# EasyEDA Pro project project.epro, schematic Schematic1
Board Name: Board1; Create Date: 2025-07-10; Page Name: P1; Project Name: Retro Core 16x32 Motherboard V4; Schematic Name: Schematic1; Update Date: 2025-07-10; Company: EasyEDA.com; Drawn: EasyEDA; Page Size: A4; Part Number: JLCPCB-002; Reviewed: EasyEDA; Version: V0.1
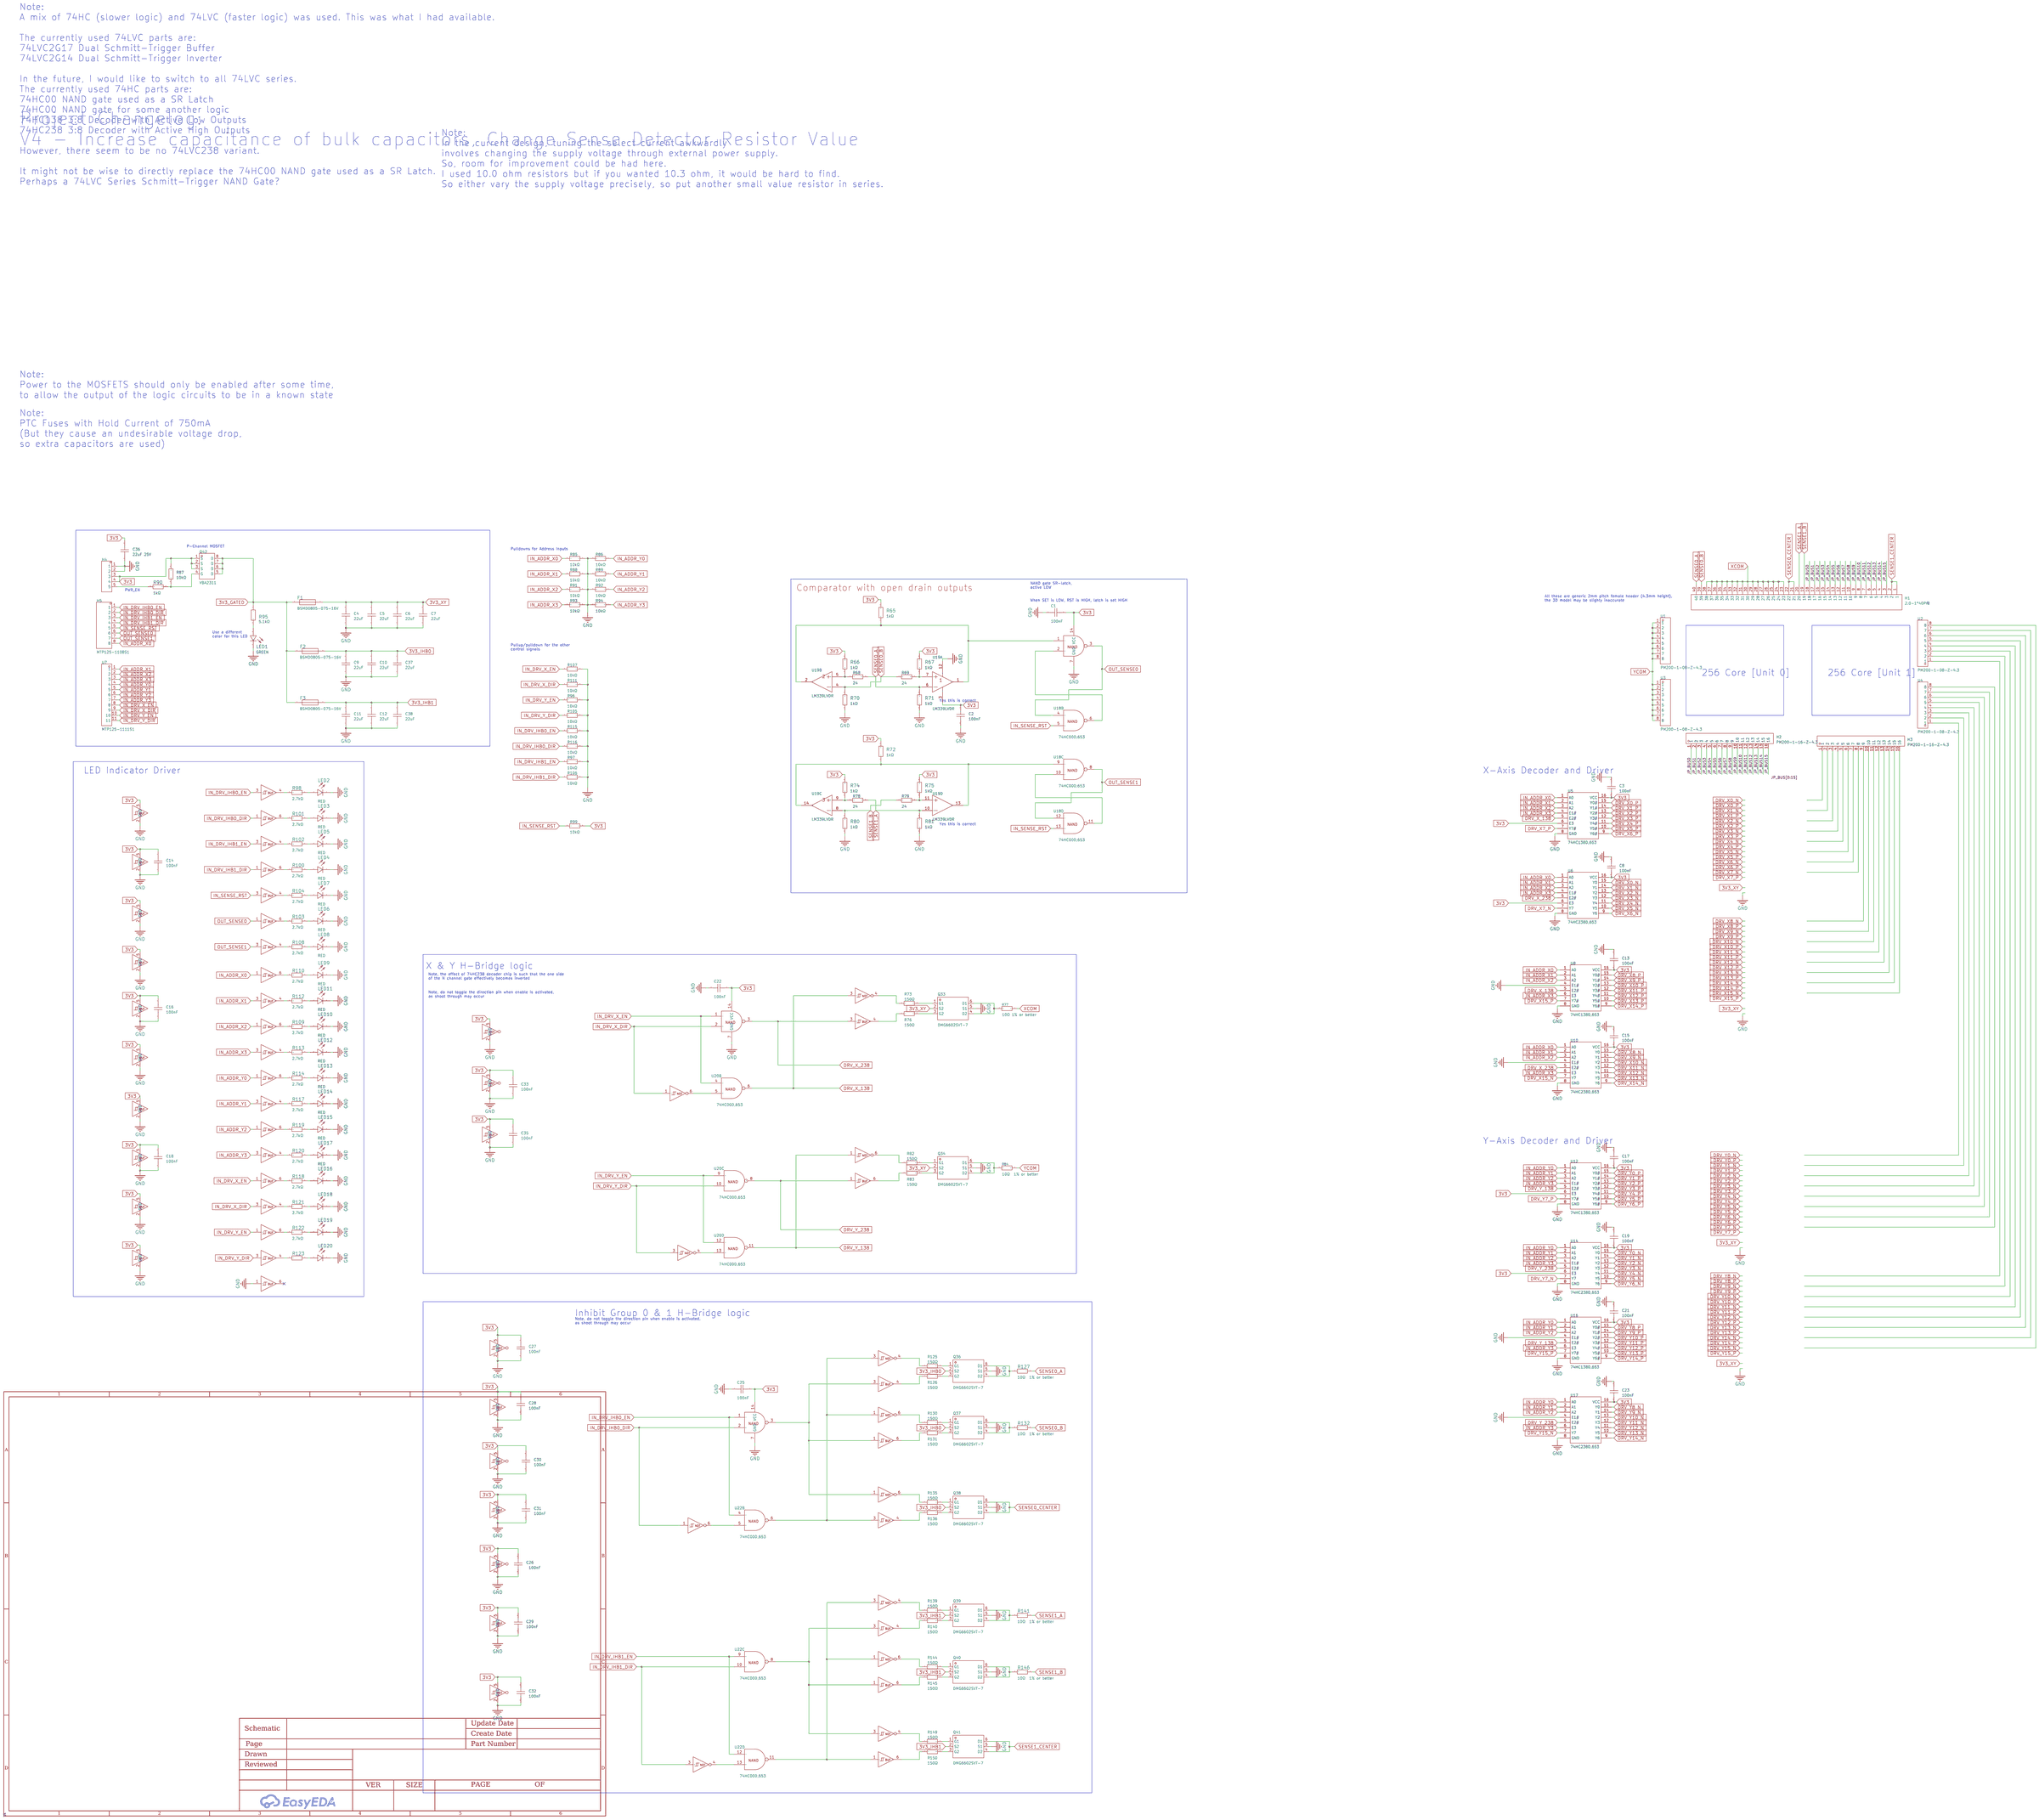
[diagram p1: schematic sheet]

## Parts
C1  100nF  [C0603]
C2  100nF  [C0603]
C3  100nF  [C0603]
C4  22uF  [C0805]
C5  22uF  [C0805]
C6  22uF  [C0805]
C7  22uF  [C0805]
C8  100nF  [C0603]
C9  22uF  [C0805]
C10  22uF  [C0805]
C11  22uF  [C0805]
C12  22uF  [C0805]
C13  100nF  [C0603]
C14  100nF  [C0603]
C15  100nF  [C0603]
C16  100nF  [C0603]
C17  100nF  [C0603]
C18  100nF  [C0603]
C19  100nF  [C0603]
C21  100nF  [C0603]
C22  100nF  [C0603]
C23  100nF  [C0603]
C25  100nF  [C0603]
C26  100nF  [C0603]
C27  100nF  [C0603]
C28  100nF  [C0603]
C29  100nF  [C0603]
C30  100nF  [C0603]
C31  100nF  [C0603]
C32  100nF  [C0603]
C33  100nF  [C0603]
C35  100nF  [C0603]
C36  22uF  [C0805]
C37  22uF  [C0805]
C38  22uF  [C0805]
CBB1  -
CBB2  -
CBB3  -
CBB4  -
F1  BSMD0805-075-16V  [F0805]
F2  BSMD0805-075-16V  [F0805]
F3  BSMD0805-075-16V  [F0805]
H1  2.0-1*40P母  [HDR-TH_40P-P2.00-V-F]
H2  PM200-1-16-Z-4.3  [HDR-TH_16P-P2.00-V-F]
H3  PM200-1-16-Z-4.3  [HDR-TH_16P-P2.00-V-F]
H4  -  [HDR-TH_5P-P2.54-V-M-NO-SILKSCREEN]
H5  MTP125-1108S1  [HDR-TH_8P-P2.54-H-M-NO-SILKSCREEN]
LED1  GREEN  [LED0603-RD]
LED2  RED  [LED0603-RD]
LED3  RED  [LED0603-RD]
LED4  RED  [LED0603-RD]
LED5  RED  [LED0603-RD]
LED6  RED  [LED0603-RD]
LED7  RED  [LED0603-RD]
LED8  RED  [LED0603-RD]
LED9  RED  [LED0603-RD]
LED10  RED  [LED0603-RD]
LED11  RED  [LED0603-RD]
LED12  RED  [LED0603-RD]
LED13  RED  [LED0603-RD]
LED14  RED  [LED0603-RD]
LED15  RED  [LED0603-RD]
LED16  RED  [LED0603-RD]
LED17  RED  [LED0603-RD]
LED18  RED  [LED0603-RD]
LED19  RED  [LED0603-RD]
LED20  RED  [LED0603-RD]
Q33  DMG6602SVT-7  [TSOT-23-6_L2.9-W1.6-P0.95-LS2.8-BR]
Q34  DMG6602SVT-7  [TSOT-23-6_L2.9-W1.6-P0.95-LS2.8-BR]
Q36  DMG6602SVT-7  [TSOT-23-6_L2.9-W1.6-P0.95-LS2.8-BR]
Q37  DMG6602SVT-7  [TSOT-23-6_L2.9-W1.6-P0.95-LS2.8-BR]
Q38  DMG6602SVT-7  [TSOT-23-6_L2.9-W1.6-P0.95-LS2.8-BR]
Q39  DMG6602SVT-7  [TSOT-23-6_L2.9-W1.6-P0.95-LS2.8-BR]
Q40  DMG6602SVT-7  [TSOT-23-6_L2.9-W1.6-P0.95-LS2.8-BR]
Q41  DMG6602SVT-7  [TSOT-23-6_L2.9-W1.6-P0.95-LS2.8-BR]
Q42  VBA2311  [SO-8_L4.9-W3.9-P1.27-LS5.9-BL]
R65  1kΩ  [R0603]
R66  1kΩ  [R0603]
R67  1kΩ  [R0603]
R68  24  [R0603]
R69  24  [R0603]
R70  1kΩ  [R0603]
R71  1kΩ  [R0603]
R72  1kΩ  [R0603]
R73  150Ω  [R0603]
R74  1kΩ  [R0603]
R75  1kΩ  [R0603]
R76  150Ω  [R0603]
R77  10Ω  [R1210]
R78  24  [R0603]
R79  24  [R0603]
R80  1kΩ  [R0603]
R81  1kΩ  [R0603]
R82  150Ω  [R0603]
R83  150Ω  [R0603]
R84  10Ω  [R1210]
R85  10kΩ  [R0603]
R86  10kΩ  [R0603]
R87  10kΩ  [R0603]
R88  10kΩ  [R0603]
R89  10kΩ  [R0603]
R90  1kΩ  [R0603]
R91  10kΩ  [R0603]
R92  10kΩ  [R0603]
R93  10kΩ  [R0603]
R94  10kΩ  [R0603]
R95  5.1kΩ  [R0603]
R96  10kΩ  [R0603]
R97  10kΩ  [R0603]
R98  2.7kΩ  [R0603]
R99  10kΩ  [R0603]
R100  2.7kΩ  [R0603]
R101  2.7kΩ  [R0603]
R102  2.7kΩ  [R0603]
R103  2.7kΩ  [R0603]
R104  2.7kΩ  [R0603]
R105  10kΩ  [R0603]
R106  10kΩ  [R0603]
R107  10kΩ  [R0603]
R108  2.7kΩ  [R0603]
R109  2.7kΩ  [R0603]
R110  2.7kΩ  [R0603]
R111  10kΩ  [R0603]
R112  2.7kΩ  [R0603]
R113  2.7kΩ  [R0603]
R114  2.7kΩ  [R0603]
R115  10kΩ  [R0603]
R116  10kΩ  [R0603]
R117  2.7kΩ  [R0603]
R118  2.7kΩ  [R0603]
R119  2.7kΩ  [R0603]
R120  2.7kΩ  [R0603]
R121  2.7kΩ  [R0603]
R122  2.7kΩ  [R0603]
R123  2.7kΩ  [R0603]
R125  150Ω  [R0603]
R126  150Ω  [R0603]
R127  10Ω  [R1210]
R130  150Ω  [R0603]
R131  150Ω  [R0603]
R132  10Ω  [R1210]
R135  150Ω  [R0603]
R136  150Ω  [R0603]
R139  150Ω  [R0603]
R140  150Ω  [R0603]
R141  10Ω  [R1210]
R144  150Ω  [R0603]
R145  150Ω  [R0603]
R146  10Ω  [R1210]
R149  150Ω  [R0603]
R150  150Ω  [R0603]
U1  PM200-1-08-Z-4.3  [HDR-TH_8P-P2.00-V-F]
U2  PM200-1-08-Z-4.3  [HDR-TH_8P-P2.00-V-F]
U3  PM200-1-08-Z-4.3  [HDR-TH_8P-P2.00-V-F]
U4  PM200-1-08-Z-4.3  [HDR-TH_8P-P2.00-V-F]
U5  74HC138D,653  [SOIC-16_L9.9-W3.9-P1.27-LS6.0-BL]
U6  74HC238D,653  [SOIC-16_L9.9-W3.9-P1.27-LS6.0-BL]
U7  MTP125-1111S1  [HDR-TH_11P-P2.54-V-M]
U8  74HC138D,653  [SOIC-16_L9.9-W3.9-P1.27-LS6.0-BL]
U10  74HC238D,653  [SOIC-16_L9.9-W3.9-P1.27-LS6.0-BL]
U12  74HC138D,653  [SOIC-16_L9.9-W3.9-P1.27-LS6.0-BL]
U14  74HC238D,653  [SOIC-16_L9.9-W3.9-P1.27-LS6.0-BL]
U16  74HC138D,653  [SOIC-16_L9.9-W3.9-P1.27-LS6.0-BL]
U17  74HC238D,653  [SOIC-16_L9.9-W3.9-P1.27-LS6.0-BL]
U18  74HC00D,653  [SOIC-14_L8.7-W3.9-P1.27-LS6.0-BL]  (sections 1,2,3,4)
U19  LM339LVDR  [SOIC-14_L8.7-W3.9-P1.27-LS6.0-BL]  (sections 1,2,3,4)
U20  74HC00D,653  [SOIC-14_L8.7-W3.9-P1.27-LS6.0-BL]  (sections 1,2,3,4)
U22  74HC00D,653  [SOIC-14_L8.7-W3.9-P1.27-LS6.0-BL]  (sections 1,2,3,4)
U26  SN74LVC2G17DBVR  [SOT-23-6_L2.9-W1.6-P0.95-LS2.8-BL]  (sections 1,3,4)
U27  SN74LVC2G17DBVR  [SOT-23-6_L2.9-W1.6-P0.95-LS2.8-BL]  (sections 1,3,4)
U28  SN74LVC2G17DBVR  [SOT-23-6_L2.9-W1.6-P0.95-LS2.8-BL]  (sections 1,3,4)
U29  SN74LVC2G17DBVR  [SOT-23-6_L2.9-W1.6-P0.95-LS2.8-BL]  (sections 1,3,4)
U30  SN74LVC2G17DBVR  [SOT-23-6_L2.9-W1.6-P0.95-LS2.8-BL]  (sections 1,3,4)
U31  SN74LVC2G17DBVR  [SOT-23-6_L2.9-W1.6-P0.95-LS2.8-BL]  (sections 1,3,4)
U32  SN74LVC2G17DBVR  [SOT-23-6_L2.9-W1.6-P0.95-LS2.8-BL]  (sections 1,3,4)
U33  SN74LVC2G17DBVR  [SOT-23-6_L2.9-W1.6-P0.95-LS2.8-BL]  (sections 1,3,4)
U34  SN74LVC2G17DBVR  [SOT-23-6_L2.9-W1.6-P0.95-LS2.8-BL]  (sections 1,3,4)
U35  SN74LVC2G17DBVR  [SOT-23-6_L2.9-W1.6-P0.95-LS2.8-BL]  (sections 1,3,4)
U36  SN74LVC2G14DBVR  [SOT-23-6_L2.9-W1.6-P0.95-LS2.8-BL]  (sections 1,2,3)
U37  SN74LVC2G14DBVR  [SOT-23-6_L2.9-W1.6-P0.95-LS2.8-BL]  (sections 1,2,3)
U38  SN74LVC2G17DBVR  [SOT-23-6_L2.9-W1.6-P0.95-LS2.8-BL]  (sections 1,3,4)
U39  SN74LVC2G14DBVR  [SOT-23-6_L2.9-W1.6-P0.95-LS2.8-BL]  (sections 1,2,3)
U40  SN74LVC2G17DBVR  [SOT-23-6_L2.9-W1.6-P0.95-LS2.8-BL]  (sections 1,3,4)
U41  SN74LVC2G14DBVR  [SOT-23-6_L2.9-W1.6-P0.95-LS2.8-BL]  (sections 1,2,3)
U42  SN74LVC2G17DBVR  [SOT-23-6_L2.9-W1.6-P0.95-LS2.8-BL]  (sections 1,3,4)
U43  SN74LVC2G14DBVR  [SOT-23-6_L2.9-W1.6-P0.95-LS2.8-BL]  (sections 1,2,3)
U44  SN74LVC2G14DBVR  [SOT-23-6_L2.9-W1.6-P0.95-LS2.8-BL]  (sections 1,2,3)
U45  SN74LVC2G17DBVR  [SOT-23-6_L2.9-W1.6-P0.95-LS2.8-BL]  (sections 1,3,4)

## Library data of the parts
C1-C3 C8 C13-C19 C21-C23 C25-C33 C35 = CAP_0603: Supplier Footprint: 0603
C4-C7 C9-C12 C36-C38 = CL21A226MAYNNNE: Capacitance: Tolerance:±20% Tolerance:±20% Voltage Rated: Temperature Coefficient:; LCSC Part Name: 22uF ±20% 25V; Supplier Part: C602037; Manufacturer: SAMSUNG(三星); Supplier Footprint: 0805; JLCPCB Part Class: Extended Part; Datasheet: https://atta.szlcsc.com/upload/public/pdf/source/20200609/C602037_1A0D619693E608A1BF6E80154254E2DB.pdf; Supplier: LCSC; Tolerance: ±20%
F1-F3 = BSMD0805-075-16V: Operating Voltage (Max):16V Current Rating (Max):40A Hold Current:750mA Trip Current:1.5A Power Dissipation:600mW Resistance - Initial (Ri) (Min):70mΩ Resistance - Post Trip (R1) (Max):385mΩ Maximum Time to Trip:200ms Operating Temperature:-40℃~+85℃ Opera; LCSC Part Name: 16V 750mA 0805自恢复; Supplier Part: C976303; Manufacturer: BHFUSE(佰宏); Supplier Footprint: 0805; JLCPCB Part Class: Extended Part; Datasheet: https://atta.szlcsc.com/upload/public/pdf/source/20230512/7A46D6CD923C15CBB98FD769C08EDD80.pdf; Supplier: LCSC; Operating Voltage (Max): 16V; Current Rating (Max): 40A; Hold Current: 750mA; Trip Current: 1.5A; Power Dissipation: 600mW; Resistance - Initial (Ri) (Min): 70mΩ; Resistance - Post Trip (R1) (Max): 385mΩ; Maximum Time to Trip: 200ms; Operating Temperature: -40℃~+85℃
H1 = 2.0-1*40P母: Holes Structure:1x40P Pitch:2mm Row Spacing:- Mounting Type:Straight Number of Rows:Single Row Number of Positions:40P Insulation Height:- Contact Material:Brass Contact Plating:Gold; LCSC Part Name: 间距:2mm 1x40P 直插; Supplier Part: C7243; Manufacturer: BOOMELE(博穆精密); Supplier Footprint: 插件,P=2mm; JLCPCB Part Class: Extended Part; Datasheet: https://atta.szlcsc.com/upload/public/pdf/source/20160318/1458266988932.pdf; Supplier: LCSC; Holes Structure: 1x40P; Pitch: 2mm; Mounting Type: Straight; Number of Rows: Single Row; Number of Positions: 40P; Contact Material: Brass; Contact Plating: Gold
H2 H3 = PM200-1-16-Z-4.3: Holes Structure:1x16P Pitch:2mm Row Spacing:- Circular Hole / Square Hole:方孔 Mounting Type:Straight Number of Rows:Plugin Number of Holes:16P Current Rating (Max):1.5A Holes Direction:Top Insulation Height:4.3mm Contact Material:Brass Operating Temperatur; LCSC Part Name: 1x16P 间距:2mm 直插; Supplier Part: C3012142; Manufacturer: HCTL(华灿天禄); Supplier Footprint: 插件,P=2mm; JLCPCB Part Class: Extended Part; Datasheet: https://atta.szlcsc.com/upload/public/pdf/source/20230609/46B4B774BFB018712E18BE862FE6FD01.pdf; Supplier: LCSC; Holes Structure: 1x16P; Pitch: 2mm; Circular Hole / Square Hole: 方孔; Mounting Type: Straight; Number of Rows: Plugin; Number of Holes: 16P; Current Rating (Max): 1.5A; Holes Direction: Top; Insulation Height: 4.3mm; Contact Material: Brass; Operating Temperature Range: -40℃~+105℃; Soldering Temperature(Max): 260℃@10S
H4 = HDR-M_2.54_1x5P: Supplier Footprint: Through
H5 = MTP125-1108S1: Pin Structure:1x8P Pitch:2.54mm Row Spacing:- Circluar Pins/Square Pins:Square Pins Mounting Type:Straight Number of Rows:Plugin Number of Pins:8P Current Rating (Max):- Voltage Rating (Max):- Length of Mating Pin:6mm Insulation Height:2.5mm Length of End; LCSC Part Name: 间距:2.54mm 1x8P 直插 方针; Supplier Part: C358689; Manufacturer: MINTRON(明硕); Supplier Footprint: 插件,P=2.54mm; JLCPCB Part Class: Extended Part; Datasheet: https://atta.szlcsc.com/upload/public/pdf/source/20190124/C358691_14EEE47B6F852A185E1BED738B24D535.pdf; Supplier: LCSC; Pin Structure: 1x8P; Pitch: 2.54mm; Circluar Pins/Square Pins: Square Pins; Mounting Type: Straight; Number of Rows: Plugin; Number of Pins: 8P; Length of Mating Pin: 6mm; Insulation Height: 2.5mm; Length of End Connection Pin: 3mm; Operating Temperature Range: -40℃~+105℃; Color: Black
LED1-LED20 = 19-217/R6C-AL1M2VY/3T: Emitted Color:Red Forward Voltage (VF):1.95V Forward Voltage (VF):1.95V Power Dissipation:60mW Forward Current:5mA Dominant Wavelength:617.5nm Dominant Wavelength:617.5nm Peak Wavelength:632nm Diode Configuration:- Lens Color:无色透明透镜 Color Temperature:- Co; LCSC Part Name: 红灯 停产; Supplier Part: C72044; Manufacturer: EVERLIGHT(亿光); Supplier Footprint: 0603; JLCPCB Part Class: Extended Part; Datasheet: https://atta.szlcsc.com/upload/public/pdf/source/20160507/1462613613821.pdf; Supplier: LCSC; Emitted Color: Red; Forward Voltage (VF): 1.95V; Power Dissipation: 60mW; Forward Current: 5mA; Dominant Wavelength: 617.5nm; Peak Wavelength: 632nm; Lens Color: 无色透明透镜; Viewing Angle: 120°; Operating Temperature: -40℃~+85℃
Q33 Q34 Q36-Q41 = DMG6602SVT-7: Type:NChannel+PChannel Drain Source Voltage (Vdss): Continuous Drain Current (Id):； Power Dissipation (Pd): Drain Source On Resistance (RDS(on)@Vgs,Id): Gate Threshold Voltage (Vgs(th)@Id):2.3V@250uA Total Gate Charge (Qg@Vgs):13nC@10V Input Capacitance (; LCSC Part Name: N沟道+P沟道 耐压:30V 电流:3.4A 电流:2.8A; Supplier Part: C110497; Manufacturer: DIODES(美台); Supplier Footprint: TSOT-23-6; JLCPCB Part Class: Extended Part; Datasheet: https://atta.szlcsc.com/upload/public/pdf/source/20170427/1493286394320.pdf; Supplier: LCSC; Type: NChannel+PChannel; Continuous Drain Current (Id): ；; Gate Threshold Voltage (Vgs(th)@Id): 2.3V@250uA; Total Gate Charge (Qg@Vgs): 13nC@10V; Input Capacitance (Ciss@Vds): 400pF@15V; Operating Temperature: -55℃~+150℃@(Tj)
Q42 = VBA2311: Type:1 Piece P-Channel Drain Source Voltage (Vdss): Continuous Drain Current (Id): Drain Source On Resistance (RDS(on)@Vgs,Id):0.011Ω@10V,10A Power Dissipation (Pd): Gate Threshold Voltage (Vgs(th)@Id):1V@250uA Total Gate Charge (Qg@Vgs):22nC@4.5V Input C; LCSC Part Name: 1个P沟道 耐压:30V 电流:11.6A; Supplier Part: C416232; Manufacturer: VBsemi(微碧半导体); Supplier Footprint: SO-8; JLCPCB Part Class: Extended Part; Datasheet: https://atta.szlcsc.com/upload/public/pdf/source/20240821/081F83DBA599FBB3A56D40F32A6B42A6.pdf; Supplier: LCSC; Type: 1 Piece P-Channel; Drain Source On Resistance (RDS(on)@Vgs,Id): 0.011Ω@10V,10A; Gate Threshold Voltage (Vgs(th)@Id): 1V@250uA; Total Gate Charge (Qg@Vgs): 22nC@4.5V; Input Capacitance (Ciss@Vds): 1.96nF@15V; Operating Temperature: -55℃~+150℃
R65-R67 R70-R72 R74 R75 R80 R81 R90 = 0603WAF1001T5E: Type:Thick Film Resistors Resistance:1kΩ Tolerance:±1% Tolerance:±1% Power(Watts): Overload Voltage (Max): Temperature Coefficient:±100ppm/℃ Temperature Coefficient:±100ppm/℃ Operating Temperature Range:-55℃~+155℃ Operating Temperature Range:-55℃~+155℃; LCSC Part Name: 1kΩ ±1% 100mW 厚膜电阻; Supplier Part: C21190; Manufacturer: UNI-ROYAL(厚声); Supplier Footprint: 0603; JLCPCB Part Class: Basic Part; Datasheet: https://atta.szlcsc.com/upload/public/pdf/source/20200306/C422600_1E6D84923E4A46A82E41ADD87F860B5C.pdf; Supplier: LCSC; Type: Thick Film Resistors; Tolerance: ±1%; Temperature Coefficient: ±100ppm/℃; Operating Temperature Range: -55℃~+155℃
R68 R69 R78 R79 = Res_0603: Supplier Footprint: 0603
R73 R76 R82 R83 R125 R126 R130 R131 R135 R136 R139 R140 R144 R145 R149 R150 = 0603WAF1500T5E: Type:Thick Film Resistors Resistance: Tolerance:±1% Tolerance:±1% Power(Watts): Overload Voltage (Max): Temperature Coefficient:±100ppm/℃ Temperature Coefficient:±100ppm/℃ Operating Temperature Range:-55℃~+155℃ Operating Temperature Range:-55℃~+155℃; LCSC Part Name: 150Ω ±1% 100mW 厚膜电阻; Supplier Part: C22808; Manufacturer: UNI-ROYAL(厚声); Supplier Footprint: 0603; JLCPCB Part Class: Basic Part; Datasheet: https://atta.szlcsc.com/upload/public/pdf/source/20200306/C422600_1E6D84923E4A46A82E41ADD87F860B5C.pdf; Supplier: LCSC; Type: Thick Film Resistors; Tolerance: ±1%; Temperature Coefficient: ±100ppm/℃; Operating Temperature Range: -55℃~+155℃
R77 R84 R127 R132 R141 R146 = 1210W2F100JT5E: Type:Thick Film Resistors Resistance:10Ω Tolerance:±1% Tolerance:±1% Power(Watts): Overload Voltage (Max): Temperature Coefficient:±200ppm/℃ Temperature Coefficient:±200ppm/℃ Operating Temperature Range:-55℃~+155℃ Operating Temperature Range:-55℃~+155℃; LCSC Part Name: 10Ω ±1% 500mW 厚膜电阻; Supplier Part: C44451; Manufacturer: UNI-ROYAL(厚声); Supplier Footprint: 1210; JLCPCB Part Class: Extended Part; Datasheet: https://atta.szlcsc.com/upload/public/pdf/source/20200306/C422600_1E6D84923E4A46A82E41ADD87F860B5C.pdf; Supplier: LCSC; Type: Thick Film Resistors; Tolerance: ±1%; Temperature Coefficient: ±200ppm/℃; Operating Temperature Range: -55℃~+155℃
R85-R89 R91-R94 R96 R97 R99 R105-R107 R111 R115 R116 = RC0603FR-0710KL: Type:Thick Film Resistors Resistance: Tolerance:±1% Tolerance:±1% Power(Watts): Overload Voltage (Max): Temperature Coefficient:±100ppm/℃ Temperature Coefficient:±100ppm/℃ Operating Temperature Range:-55℃~+155℃ Operating Temperature Range:-55℃~+155℃; LCSC Part Name: 厚膜电阻 10kΩ ±1% 100mW; Supplier Part: C98220; Manufacturer: YAGEO(国巨); Supplier Footprint: 0603; JLCPCB Part Class: Extended Part; Datasheet: https://atta.szlcsc.com/upload/public/pdf/source/20180927/C295883_E8D83085EA81BD7DE0B2B681138C15EE.pdf; Supplier: LCSC; Type: Thick Film Resistors; Tolerance: ±1%; Temperature Coefficient: ±100ppm/℃; Operating Temperature Range: -55℃~+155℃
R95 = 0603WAJ0512T5E: Type:Thick Film Resistors Resistance:5.1kΩ Tolerance:±5% Tolerance:±5% Power(Watts): Overload Voltage (Max): Temperature Coefficient:±100ppm/℃ Temperature Coefficient:±100ppm/℃ Operating Temperature Range:-55℃~+155℃ Operating Temperature Range:-55℃~+155℃; LCSC Part Name: 5.1kΩ ±5% 100mW 厚膜电阻; Supplier Part: C26000; Manufacturer: UNI-ROYAL(厚声); Supplier Footprint: 0603; JLCPCB Part Class: Extended Part; Datasheet: https://atta.szlcsc.com/upload/public/pdf/source/20200306/C422600_1E6D84923E4A46A82E41ADD87F860B5C.pdf; Supplier: LCSC; Type: Thick Film Resistors; Tolerance: ±5%; Temperature Coefficient: ±100ppm/℃; Operating Temperature Range: -55℃~+155℃
R98 R100-R104 R108-R110 R112-R114 R117-R123 = 0603WAJ0272T5E: Type:Thick Film Resistors Resistance:2.7kΩ Tolerance:±5% Tolerance:±5% Power(Watts): Overload Voltage (Max): Temperature Coefficient:±100ppm/℃ Temperature Coefficient:±100ppm/℃ Operating Temperature Range:-55℃~+155℃ Operating Temperature Range:-55℃~+155℃; LCSC Part Name: 2.7kΩ ±5% 100mW 厚膜电阻; Supplier Part: C25994; Manufacturer: UNI-ROYAL(厚声); Supplier Footprint: 0603; JLCPCB Part Class: Extended Part; Datasheet: https://atta.szlcsc.com/upload/public/pdf/source/20200306/C422600_1E6D84923E4A46A82E41ADD87F860B5C.pdf; Supplier: LCSC; Type: Thick Film Resistors; Tolerance: ±5%; Temperature Coefficient: ±100ppm/℃; Operating Temperature Range: -55℃~+155℃
U1-U4 = PM200-1-08-Z-4.3_C3012134: Holes Structure:1x8P Pitch:2mm Row Spacing:- Circular Hole / Square Hole:Square Hole Mounting Type:Direct Insert Number of Rows:Single Row Number of Holes:8P Current Rating (Max):1.5A Holes Direction:Top Insulation Height:4.3mm Contact Material:Brass Oper; LCSC Part Name: 1x8P 间距:2mm 直插; Supplier Part: C3012134; Manufacturer: HCTL(华灿天禄); Supplier Footprint: 插件,P=2mm; JLCPCB Part Class: Extended Part; Datasheet: https://atta.szlcsc.com/upload/public/pdf/source/20230609/46B4B774BFB018712E18BE862FE6FD01.pdf; Supplier: LCSC; Holes Structure: 1x8P; Pitch: 2mm; Circular Hole / Square Hole: Square Hole; Mounting Type: Direct Insert; Number of Rows: Single Row; Number of Holes: 8P; Current Rating (Max): 1.5A; Holes Direction: Top; Insulation Height: 4.3mm; Contact Material: Brass; Operating Temperature Range: -40℃~+105℃
U5 U8 U12 U16 = 74HC138D,653: Type:Decoder/Demultiplexers Voltage Supply Source:Single supply Supply Voltage:2V~6V Supply Voltage:2V~6V Number of lines:3~8 Number of lines:3~8 Sink Current:5.2mA Source Current:5.2mA Operating temperature:-40℃~+125℃ Operating temperature:-40℃~+125℃; Supplier Part: C5602; Manufacturer: Nexperia(安世); Supplier Footprint: SOIC-16; JLCPCB Part Class: Extended Part; Datasheet: https://atta.szlcsc.com/upload/public/pdf/source/20160918/1474193369767.pdf; Supplier: LCSC; Type: Decoder/Demultiplexers; Voltage Supply Source: Single supply; Supply Voltage: 2V~6V; Number of lines: 3~8; Sink Current: 5.2mA; Source Current: 5.2mA; Operating temperature: -40℃~+125℃
U6 U10 U14 U17 = 74HC238D,653: Type:Decoder/Demultiplexers Voltage Supply Source:Single supply Supply Voltage:2V~6V Supply Voltage:2V~6V Sink Current:5.2mA Source Current:5.2mA Operating temperature:-40℃~+125℃ Operating temperature:-40℃~+125℃; Supplier Part: C5620; Manufacturer: Nexperia(安世); Supplier Footprint: SOIC-16; JLCPCB Part Class: Extended Part; Datasheet: https://atta.szlcsc.com/upload/public/pdf/source/20240724/CF623EBC33D9A16245E2D43D3B771059.pdf; Supplier: LCSC; Type: Decoder/Demultiplexers; Voltage Supply Source: Single supply; Supply Voltage: 2V~6V; Sink Current: 5.2mA; Source Current: 5.2mA; Operating temperature: -40℃~+125℃
U7 = MTP125-1111S1: Pin Structure:1x11P Pitch:2.54mm Number of Rows:Single Row Number of Pins:11P; Supplier Part: C5142337; Manufacturer: MINTRON(明硕); Supplier Footprint: 插件,P=2.54mm; Datasheet: https://atta.szlcsc.com/upload/public/pdf/source/20220902/9ECAB3EED44C6BACCECEC5EDD24715AC.pdf; Supplier: LCSC; Pin Structure: 1x11P; Pitch: 2.54mm; Number of Rows: Single Row; Number of Pins: 11P
U18 U20 U22 = 74HC00D,653 Multi-Part Logic: Logic Gate Type:与Non-门 Number of Channels:4 Supply Voltage:2V~6V Supply Voltage:2V~6V Quiescent Current (Max):40uA Sink Current:5.2mA Source Current:5.2mA High Level Range (VIH):1.5V~4.2V High Level Range (VIH):1.5V~4.2V Low Level Range (VIL):500mV~1.8V L; Supplier Part: C5586; Manufacturer: Nexperia(安世); Supplier Footprint: SOIC-14; JLCPCB Part Class: Extended Part; Datasheet: https://atta.szlcsc.com/upload/public/pdf/source/20120504/1457706487090.pdf; Supplier: LCSC; Logic Gate Type: 与Non-门; Number of Channels: 4; Supply Voltage: 2V~6V; Sink Current: 5.2mA; Source Current: 5.2mA; High Level Range (VIH): 1.5V~4.2V; Low Level Range (VIL): 500mV~1.8V; Series: 74HCSeries; Propagation Delay Time: 7ns@6V,50pF; Operating Temperature: -40℃~+125℃; Quiescent Current (Max): 40uA
U19 = LM339LVDR: Supplier Part: C22427665; Manufacturer: TI(德州仪器); Supplier Footprint: SOIC-14; JLCPCB Part Class: Extended Part; Supplier: LCSC
U26-U35 U38 U40 U42 U45 = SN74LVC2G17DBVR Multi-Part Logic: Input type:Schmitt Trigger output type:- Voltage - Supply:1.65V~5.5V Voltage - Supply:1.65V~5.5V Number of Elements:2 Number of Bits per Element:1 Channel Type:- Current - Output Low(IOL):32mA Current - Output High(IOH):32mA Logic Family:74LVC Operating T; Supplier Part: C10429; Manufacturer: TI(德州仪器); Supplier Footprint: SOT-23-6; JLCPCB Part Class: Extended Part; Datasheet: https://www.ti.com/cn/lit/gpn/sn74lvc2g17; Supplier: LCSC; Input type: Schmitt Trigger; Voltage - Supply: 1.65V~5.5V; Number of Elements: 2; Number of Bits per Element: 1; Current - Output Low(IOL): 32mA; Current - Output High(IOH): 32mA; Logic Family: 74LVC; Operating Temperature: -40℃~+85℃
U36 U37 U39 U41 U43 U44 = SN74LVC2G14DBVR Multi-Part Logic: Input Type:Schmitt Trigger Voltage - Supply:1.65V~5.5V Voltage - Supply:1.65V~5.5V Current - Supply:10uA Number of Circuits:2 Number of Inputs:2 Current - Output Low(IOL):32mA Current - Output High(IOH):32mA Input Logic Level - High:1.4V~3.7V Input Logic; Supplier: LCSC; Manufacturer: TI(德州仪器); Supplier Part: C12401; JLCPCB Part Class: Extended Part; LCSC Part Name: 双路施密特触发反相器; Supplier Footprint: SOT-23-6; Datasheet: https://www.ti.com/cn/lit/gpn/sn74lvc2g14; Input Type: Schmitt Trigger; Voltage - Supply: 1.65V~5.5V; Current - Supply: 10uA; Number of Circuits: 2; Number of Inputs: 2; Current - Output Low(IOL): 32mA; Current - Output High(IOH): 32mA; Input Logic Level - High: 1.4V~3.7V; Input Logic Level -Low: 300mV~1.4V; Max Propagation Delay: 4.7ns@5V,50pF; Series: 74LVCSeries; Operating Temperature: -40℃~+125℃

## Nets
3V3: C1.2 C2.1 C3.2 C8.2 C13.2 C14.1 C15.2 C16.2 C17.2 C18.2 C19.2 C21.2 C22.1 C23.2 C25.1 C26.1 C27.1 C28.1 C29.1 C30.1 C31.1 C32.1 C33.1 C35.1 C36.2 H4.3 H4.4 Q42.1(S) Q42.2(S) Q42.3(S) R65.2 R66.2 R67.2 R72.2 R74.2 R75.2 R87.1 R99.2 U5.6(E3) U5.16(VCC) U6.6(E3) U6.16(VCC) U8.16(VCC) U10.16(VCC) U12.6(E3) U12.16(VCC) U14.6(E3) U14.16(VCC) U16.16(VCC) U17.16(VCC) U18.14(VCC) U19.3(VCC) U20.14(VCC) U22.14(VCC) U26.5(VCC) U27.5(VCC) U28.5(VCC) U29.5(VCC) U30.5(VCC) U31.5(VCC) U32.5(VCC) U33.5(VCC) U34.5(VCC) U35.5(VCC) U36.5(VCC) U37.5(VCC) U38.5(VCC) U39.5(VCC) U40.5(VCC) U41.5(VCC) U42.5(VCC) U43.5(VCC) U44.5(VCC) U45.5(VCC)
3V3_GATED: F1.1 F2.1 F3.1 Q42.5(D) Q42.6(D) Q42.7(D) Q42.8(D) R95.1
3V3_IHB0: C9.2 C10.2 C37.2 F2.2 Q36.2(S2) Q37.2(S2) Q38.2(S2)
3V3_IHB1: C11.2 C12.2 C38.2 F3.2 Q39.2(S2) Q40.2(S2) Q41.2(S2)
3V3_XY: C4.2 C5.2 C6.2 C7.2 CBB1.17(VCC) CBB2.17(VCC) CBB3.17(VCC) CBB4.17(VCC) F1.2 Q33.2(S2) Q34.2(S2)
GND: C1.1 C2.2 C3.1 C4.1 C5.1 C6.1 C7.1 C8.1 C9.1 C10.1 C11.1 C12.1 C13.1 C14.2 C15.1 C16.1 C17.1 C18.1 C19.1 C21.1 C22.2 C23.1 C25.2 C26.2 C27.2 C28.2 C29.2 C30.2 C31.2 C32.2 C33.2 C35.2 C36.1 C37.1 C38.1 CBB1.18(GND) CBB2.18(GND) CBB3.18(GND) CBB4.18(GND) H4.1 H4.2 LED1.1(C) LED2.1(C) LED3.1(C) LED4.1(C) LED5.1(C) LED6.1(C) LED7.1(C) LED8.1(C) LED9.1(C) LED10.1(C) LED11.1(C) LED12.1(C) LED13.1(C) LED14.1(C) LED15.1(C) LED16.1(C) LED17.1(C) LED18.1(C) LED19.1(C) LED20.1(C) Q33.5(S1) Q34.5(S1) Q36.5(S1) Q37.5(S1) Q38.5(S1) Q39.5(S1) Q40.5(S1) Q41.5(S1) R70.1 R71.1 R80.1 R81.1 R85.1 R86.2 R88.1 R89.1 R91.1 R92.2 R93.1 R94.2 R96.1 R97.2 R105.2 R106.2 R107.2 R111.2 R115.1 R116.2 U5.8(GND) U6.8(GND) U8.4(E1#) U8.8(GND) U10.4(E1#) U10.8(GND) U12.8(GND) U14.8(GND) U16.4(E1#) U16.8(GND) U17.4(E1#) U17.8(GND) U18.7(GND) U19.12(GND) U20.7(GND) U22.7(GND) U26.2(GND) U27.2(GND) U28.2(GND) U29.2(GND) U30.2(GND) U31.2(GND) U32.2(GND) U33.2(GND) U34.2(GND) U35.1(1A) U35.2(GND) U36.2(GND) U37.2(GND) U38.2(GND) U39.2(GND) U40.2(GND) U41.2(GND) U42.2(GND) U43.2(GND) U44.2(GND) U45.2(GND)
DRV_X0_N: CBB1.1(IN0_N) U6.15(Y0)
DRV_X0_P: CBB1.2(IN0_P) U5.15(Y0#)
DRV_X1_N: CBB1.3(IN1_N) U6.14(Y1)
DRV_X1_P: CBB1.4(IN1_P) U5.14(Y1#)
DRV_X2_N: CBB1.5(IN2_N) U6.13(Y2)
DRV_X2_P: CBB1.6(IN2_P) U5.13(Y2#)
DRV_X3_N: CBB1.7(IN3_N) U6.12(Y3)
DRV_X3_P: CBB1.8(IN3_P) U5.12(Y3#)
DRV_X4_N: CBB1.9(IN4_N) U6.11(Y4)
DRV_X4_P: CBB1.10(IN4_P) U5.11(Y4#)
DRV_X5_N: CBB1.11(IN5_N) U6.10(Y5)
DRV_X5_P: CBB1.12(IN5_P) U5.10(Y5#)
DRV_X6_N: CBB1.13(IN6_N) U6.9(Y6)
DRV_X6_P: CBB1.14(IN6_P) U5.9(Y6#)
DRV_X7_N: CBB1.15(IN7_N) U6.7(Y7)
DRV_X7_P: CBB1.16(IN7_P) U5.7(Y7#)
DRV_X8_N: CBB2.1(IN0_N) U10.15(Y0)
DRV_X8_P: CBB2.2(IN0_P) U8.15(Y0#)
DRV_X9_N: CBB2.3(IN1_N) U10.14(Y1)
DRV_X9_P: CBB2.4(IN1_P) U8.14(Y1#)
DRV_X10_N: CBB2.5(IN2_N) U10.13(Y2)
DRV_X10_P: CBB2.6(IN2_P) U8.13(Y2#)
DRV_X11_N: CBB2.7(IN3_N) U10.12(Y3)
DRV_X11_P: CBB2.8(IN3_P) U8.12(Y3#)
DRV_X12_N: CBB2.9(IN4_N) U10.11(Y4)
DRV_X12_P: CBB2.10(IN4_P) U8.11(Y4#)
DRV_X13_N: CBB2.11(IN5_N) U10.10(Y5)
DRV_X13_P: CBB2.12(IN5_P) U8.10(Y5#)
DRV_X14_N: CBB2.13(IN6_N) U10.9(Y6)
DRV_X14_P: CBB2.14(IN6_P) U8.9(Y6#)
DRV_X15_N: CBB2.15(IN7_N) U10.7(Y7)
DRV_X15_P: CBB2.16(IN7_P) U8.7(Y7#)
DRV_X_138: U5.5(E2#) U8.5(E2#) U20.6(2Y) U44.3(2A)
DRV_X_238: U6.5(E2#) U10.5(E2#) U20.3(1Y) U45.3(2A)
DRV_Y0_N: CBB3.1(IN0_N) U14.15(Y0)
DRV_Y0_P: CBB3.2(IN0_P) U12.15(Y0#)
DRV_Y1_N: CBB3.3(IN1_N) U14.14(Y1)
DRV_Y1_P: CBB3.4(IN1_P) U12.14(Y1#)
DRV_Y2_N: CBB3.5(IN2_N) U14.13(Y2)
DRV_Y2_P: CBB3.6(IN2_P) U12.13(Y2#)
DRV_Y3_N: CBB3.7(IN3_N) U14.12(Y3)
DRV_Y3_P: CBB3.8(IN3_P) U12.12(Y3#)
DRV_Y4_N: CBB3.9(IN4_N) U14.11(Y4)
DRV_Y4_P: CBB3.10(IN4_P) U12.11(Y4#)
DRV_Y5_N: CBB3.11(IN5_N) U14.10(Y5)
DRV_Y5_P: CBB3.12(IN5_P) U12.10(Y5#)
DRV_Y6_N: CBB3.13(IN6_N) U14.9(Y6)
DRV_Y6_P: CBB3.14(IN6_P) U12.9(Y6#)
DRV_Y7_N: CBB3.15(IN7_N) U14.7(Y7)
DRV_Y7_P: CBB3.16(IN7_P) U12.7(Y7#)
DRV_Y8_N: CBB4.1(IN0_N) U17.15(Y0)
DRV_Y8_P: CBB4.2(IN0_P) U16.15(Y0#)
DRV_Y9_N: CBB4.3(IN1_N) U17.14(Y1)
DRV_Y9_P: CBB4.4(IN1_P) U16.14(Y1#)
DRV_Y10_N: CBB4.5(IN2_N) U17.13(Y2)
DRV_Y10_P: CBB4.6(IN2_P) U16.13(Y2#)
DRV_Y11_N: CBB4.7(IN3_N) U17.12(Y3)
DRV_Y11_P: CBB4.8(IN3_P) U16.12(Y3#)
DRV_Y12_N: CBB4.9(IN4_N) U17.11(Y4)
DRV_Y12_P: CBB4.10(IN4_P) U16.11(Y4#)
DRV_Y13_N: CBB4.11(IN5_N) U17.10(Y5)
DRV_Y13_P: CBB4.12(IN5_P) U16.10(Y5#)
DRV_Y14_N: CBB4.13(IN6_N) U17.9(Y6)
DRV_Y14_P: CBB4.14(IN6_P) U16.9(Y6#)
DRV_Y15_N: CBB4.15(IN7_N) U17.7(Y7)
DRV_Y15_P: CBB4.16(IN7_P) U16.7(Y7#)
DRV_Y_138: U12.5(E2#) U16.5(E2#) U20.11(4Y) U44.1(1A)
DRV_Y_238: U14.5(E2#) U17.5(E2#) U20.8(3Y) U45.1(1A)
IN_ADDR_X0: H5.8 R85.2 U5.1(A0) U6.1(A0) U8.1(A0) U10.1(A0) U29.1(1A)
IN_ADDR_X1: R88.2 U5.2(A1) U6.2(A1) U7.1 U8.2(A1) U10.2(A1) U30.3(2A)
IN_ADDR_X2: R91.2 U5.3(A2) U6.3(A2) U7.2 U8.3(A2) U10.3(A2) U30.1(1A)
IN_ADDR_X3: R93.2 U5.4(E1#) U6.4(E1#) U7.3 U8.6(E3) U10.6(E3) U31.3(2A)
IN_ADDR_Y0: R86.1 U7.4 U12.1(A0) U14.1(A0) U16.1(A0) U17.1(A0) U31.1(1A)
IN_ADDR_Y1: R89.2 U7.5 U12.2(A1) U14.2(A1) U16.2(A1) U17.2(A1) U32.3(2A)
IN_ADDR_Y2: R92.1 U7.6 U12.3(A2) U14.3(A2) U16.3(A2) U17.3(A2) U32.1(1A)
IN_ADDR_Y3: R94.1 U7.7 U12.4(E1#) U14.4(E1#) U16.6(E3) U17.6(E3) U33.3(2A)
IN_DRV_IHB0_DIR: H5.2 R116.1 U22.2(1B) U26.1(1A) U37.1(1A)
IN_DRV_IHB0_EN: H5.1 R115.2 U22.1(1A) U22.4(2A) U26.3(2A)
IN_DRV_IHB1_DIR: H5.4 R106.1 U22.10(3B) U27.1(1A) U37.3(2A)
IN_DRV_IHB1_EN: H5.3 R97.1 U22.9(3A) U22.12(4A) U27.3(2A)
IN_DRV_X_DIR: R111.1 U7.9 U20.2(1B) U34.3(2A) U43.1(1A)
IN_DRV_X_EN: R107.1 U7.8 U20.1(1A) U20.4(2A) U33.1(1A)
IN_DRV_Y_DIR: R105.1 U7.11 U20.10(3B) U35.3(2A) U43.3(2A)
IN_DRV_Y_EN: R96.2 U7.10 U20.9(3A) U20.12(4A) U34.1(1A)
IN_SENSE_RST: H5.5 R99.1 U18.5(2B) U18.13(4B) U28.3(2A)
JP_BUS0: H1.18 H2.1
JP_BUS1: H1.17 H2.2
JP_BUS2: H1.16 H2.3
JP_BUS3: H1.15 H2.4
JP_BUS4: H1.14 H2.5
JP_BUS5: H1.13 H2.6
JP_BUS6: H1.12 H2.7
JP_BUS7: H1.11 H2.8
JP_BUS8: H1.10 H2.9
JP_BUS9: H1.9 H2.10
JP_BUS10: H1.8 H2.11
JP_BUS11: H1.7 H2.12
JP_BUS12: H1.6 H2.13
JP_BUS13: H1.5 H2.14
JP_BUS14: H1.4 H2.15
JP_BUS15: H1.3 H2.16
OUT_SENSE0: H5.6 U18.3(1Y) U18.4(2A) U28.1(1A)
OUT_SENSE1: H5.7 U18.8(3Y) U18.12(4A) U29.3(2A)
SENSE0_A: H1.40 R68.2 R71.2 R127.1 U19.6(IN1-)
SENSE0_B: H1.39 R69.1 R70.2 R132.1 U19.4(IN2-)
SENSE0_CENTER: H1.21 H1.22 Q38.4(D2) Q38.6(D1)
SENSE1_A: H1.20 R78.2 R81.2 R141.1 U19.10(4IN−)
SENSE1_B: H1.19 R79.1 R80.2 R146.1 U19.8(IN3-)
SENSE1_CENTER: H1.1 H1.2 Q41.4(D2) Q41.6(D1)
XCOM: H1.23 H1.24 H1.25 H1.26 H1.27 H1.28 H1.29 H1.30 H1.31 H1.32 H1.33 H1.34 H1.35 H1.36 H1.37 H1.38 R77.1
YCOM: R84.1 U1.1 U1.2 U1.3 U1.4 U1.5 U1.6 U1.7 U1.8 U3.1 U3.2 U3.3 U3.4 U3.5 U3.6 U3.7 U3.8
$1N6793: LED5.2(A) R102.1
$1N8285: LED4.2(A) R100.2
$1N8290: LED6.2(A) R103.2
$1N10722: LED9.2(A) R110.1
$1N10724: LED11.2(A) R112.1
$1N10726: LED8.2(A) R108.1
$1N12499: LED14.2(A) R117.1
$1N34208: Q42.4(G) R87.2 R90.1
$1N85592: Q34.4(D2) Q34.6(D1) R84.2
$1N85600: Q33.4(D2) Q33.6(D1) R77.2
$1N85641: Q33.1(G1) R73.2
$1N85682: Q33.3(G2) R76.2
$1N85721: Q34.1(G1) R82.2
$1N85760: Q34.3(G2) R83.2
$1N86284: Q36.3(G2) R126.2
$1N86286: Q37.1(G1) R130.2
$1N86288: Q37.3(G2) R131.2
$1N86323: Q36.4(D2) Q36.6(D1) R127.2
$1N87818: R73.1 U44.4(2Y)
$1N87831: R76.1 U45.4(2Y)
$1N87845: R82.1 U44.6(1Y)
$1N87858: R83.1 U45.6(1Y)
$1N88218: H4.5 R90.2
$1N92958: U22.3(1Y) U38.1(1A) U38.3(2A) U39.1(1A)
$1N116288: Q36.1(G1) R125.2
$1N116317: Q37.4(D2) Q37.6(D1) R132.2
$1N117069: Q38.3(G2) R136.2
$1N117074: Q38.1(G1) R135.2
$1N117219: U22.5(2B) U37.6(1Y)
$1N158633: R135.1 U39.6(1Y)
$1N159837: Q41.1(G1) R149.2
$1N159840: Q41.3(G2) R150.2
$1N159842: Q40.3(G2) R145.2
$1N159848: Q40.1(G1) R144.2
$1N159849: Q39.3(G2) R140.2
$1N159852: Q39.4(D2) Q39.6(D1) R141.2
$1N159853: Q40.4(D2) Q40.6(D1) R146.2
$1N159855: Q39.1(G1) R139.2
$1N159864: U22.13(4B) U37.4(2Y)
$1N159876: R149.1 U39.4(2Y)
$1N161280: U20.13(4B) U43.4(2Y)
$1N162043: U18.2(1B) U18.6(2Y)
$1N162202: U18.10(3B) U18.11(4Y)
$1N162312: R65.1 U18.1(1A) U19.1(OUT1) U19.2(OUT2)
$1N162440: R66.1 R68.1 U19.5(IN2+)
$1N162442: R67.1 R69.2 U19.7(IN1+)
$1N162725: R72.1 U18.9(3A) U19.13(OUT4) U19.14(OUT3)
$1N163428: R75.1 R79.2 U19.11(4IN+)
$1N163467: R74.1 R78.1 U19.9(IN3+)
$1N270627: R98.2 U26.4(2Y)
$1N270629: R101.2 U26.6(1Y)
$1N270631: LED2.2(A) R98.1
$1N270633: LED3.2(A) R101.1
$1N270816: R102.2 U27.4(2Y)
$1N271153: R104.1 U28.4(2Y)
$1N271177: R100.1 U27.6(1Y)
$1N271179: LED7.2(A) R104.2
$1N271181: R103.1 U28.6(1Y)
$1N272502: R110.2 U29.6(1Y)
$1N272510: R112.2 U30.4(2Y)
$1N272519: R108.2 U29.4(2Y)
$1N272528: R109.2 U30.6(1Y)
$1N272535: R114.2 U31.6(1Y)
$1N272601: LED10.2(A) R109.1
$1N272603: LED12.2(A) R113.1
$1N272605: LED13.2(A) R114.1
$1N273596: R119.2 U32.6(1Y)
$1N273604: R120.2 U33.4(2Y)
$1N273608: LED17.2(A) R120.1
$1N273613: R117.2 U32.4(2Y)
$1N273617: R121.1 U34.4(2Y)
$1N273621: LED16.2(A) R118.2
$1N273622: R118.1 U33.6(1Y)
$1N273629: R122.1 U34.6(1Y)
$1N273692: LED15.2(A) R119.1
$1N274851: LED20.2(A) R123.1
$1N274908: LED18.2(A) R121.2
$1N274912: LED19.2(A) R122.2
$1N294904: R125.1 U36.4(2Y)
$1N294932: R130.1 U36.6(1Y)
$1N435889: R113.2 U31.4(2Y)
$1N436520: R123.2 U35.4(2Y)
$1N436728: R126.1 U38.4(2Y)
$1N436748: R131.1 U38.6(1Y)
$1N436840: U22.6(2Y) U36.1(1A) U36.3(2A) U40.3(2A)
$1N437130: R136.1 U40.4(2Y)
$1N437759: R139.1 U41.4(2Y)
$1N437764: R140.1 U42.4(2Y)
$1N437769: R144.1 U41.6(1Y)
$1N437776: R145.1 U42.6(1Y)
$1N437785: U22.11(4Y) U40.1(1A) U41.1(1A) U41.3(2A)
$1N437808: U22.8(3Y) U39.3(2A) U42.1(1A) U42.3(2A)
$1N438003: R150.1 U40.6(1Y)
$1N447003: U20.5(2B) U43.6(1Y)
$1N456031: LED1.2(A) R95.2
Net-(CBB1-19): CBB1.19(OUT7) H3.8
Net-(CBB1-20): CBB1.20(OUT6) H3.7
Net-(CBB1-21): CBB1.21(OUT5) H3.6
Net-(CBB1-22): CBB1.22(OUT4) H3.5
Net-(CBB1-23): CBB1.23(OUT3) H3.4
Net-(CBB1-24): CBB1.24(OUT2) H3.3
Net-(CBB1-25): CBB1.25(OUT1) H3.2
Net-(CBB1-26): CBB1.26(OUT0) H3.1
Net-(CBB2-19): CBB2.19(OUT7) H3.16
Net-(CBB2-20): CBB2.20(OUT6) H3.15
Net-(CBB2-21): CBB2.21(OUT5) H3.14
Net-(CBB2-22): CBB2.22(OUT4) H3.13
Net-(CBB2-23): CBB2.23(OUT3) H3.12
Net-(CBB2-24): CBB2.24(OUT2) H3.11
Net-(CBB2-25): CBB2.25(OUT1) H3.10
Net-(CBB2-26): CBB2.26(OUT0) H3.9
Net-(CBB3-19): CBB3.19(OUT7) U4.8
Net-(CBB3-20): CBB3.20(OUT6) U4.7
Net-(CBB3-21): CBB3.21(OUT5) U4.6
Net-(CBB3-22): CBB3.22(OUT4) U4.5
Net-(CBB3-23): CBB3.23(OUT3) U4.4
Net-(CBB3-24): CBB3.24(OUT2) U4.3
Net-(CBB3-25): CBB3.25(OUT1) U4.2
Net-(CBB3-26): CBB3.26(OUT0) U4.1
Net-(CBB4-19): CBB4.19(OUT7) U2.8
Net-(CBB4-20): CBB4.20(OUT6) U2.7
Net-(CBB4-21): CBB4.21(OUT5) U2.6
Net-(CBB4-22): CBB4.22(OUT4) U2.5
Net-(CBB4-23): CBB4.23(OUT3) U2.4
Net-(CBB4-24): CBB4.24(OUT2) U2.3
Net-(CBB4-25): CBB4.25(OUT1) U2.2
Net-(CBB4-26): CBB4.26(OUT0) U2.1

Not connected (* = marked no-connect by the designer): U35 6(1Y)*

## Notes on the sheet
- Project Changelog:
  V4 - Increase capacitance of bulk capacitors, Change Sense Detector Resistor Value
- Note:
  A mix of 74HC (slower logic) and 74LVC (faster logic) was used. This was what I had available.
  The currently used 74LVC parts are:
  74LVC2G17 Dual Schmitt-Trigger Buffer
  74LVC2G14 Dual Schmitt-Trigger Inverter
  In the future, I would like to switch to all 74LVC series.
  The currently used 74HC parts are:
  74HC00 NAND gate used as a SR Latch
  74HC00 NAND gate for some another logic
  74HC138 3:8 Decoder with Active Low Outputs
  74HC238 3:8 Decoder with Active High Outputs
  However, there seem to be no 74LVC238 variant.
  It might not be wise to directly replace the 74HC00 NAND gate used as a SR Latch.
  Perhaps a 74LVC Series Schmitt-Trigger NAND Gate?
- Note:
  In the current design, tuning the select current awkwardly
  involves changing the supply voltage through external power supply.
  So, room for improvement could be had here.
  I used 10.0 ohm resistors but if you wanted 10.3 ohm, it would be hard to find.
  So either vary the supply voltage precisely, so put another small value resistor in series.
- Note:
  Power to the MOSFETS should only be enabled after some time,
  to allow the output of the logic circuits to be in a known state
- Note:
  PTC Fuses with Hold Current of 750mA
  (But they cause an undesirable voltage drop,
  so extra capacitors are used)
- P-Channel MOSFET
- Pulldowns for Address Inputs
- PWR_EN
- Comparator with open drain outputs
- NAND gate SR-latch,
  active LOW
- When SET is LOW, RST is HIGH, latch is set HIGH
- All these are generic 2mm pitch female header (4.3mm height),
  the 3D model may be slighty inaccurate
- Use a different
  color for this LED
- Pullup/pulldown for the other
  control signals
- 256 Core [Unit 0]
- 256 Core [Unit 1]
- Yes this is correct
- LED Indicator Driver
- X-Axis Decoder and Driver
- Yes this is correct
- X & Y H-Bridge logic
- Note, the effect of 74HC238 decoder chip is such that the one side
  of the N channel gate effectively becomes inverted
- Note, do not toggle the direction pin when enable is activated,
  as shoot through may occur
- Y-Axis Decoder and Driver
- Inhibit Group 0 & 1 H-Bridge logic
- Note, do not toggle the direction pin when enable is activated,
  as shoot through may occur
